# EAGLE schematic untitled (EAGLE 9.6.2)
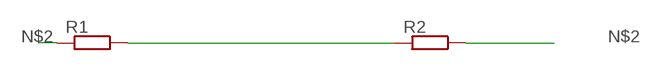
[diagram p0: schematic, sheet 1]

## Parts
R1  SMR  [SMR]
R2  SMR  [SMR]

## Nets
N$1: R1.1 R2.2
N$2: R1.2 R2.1

## Library data of the parts
R1 R2 = resistor-shunt:SMR: SMD SHUNT RESISTOR; OC_FARNELL: unknown; OC_NEWARK: unknown